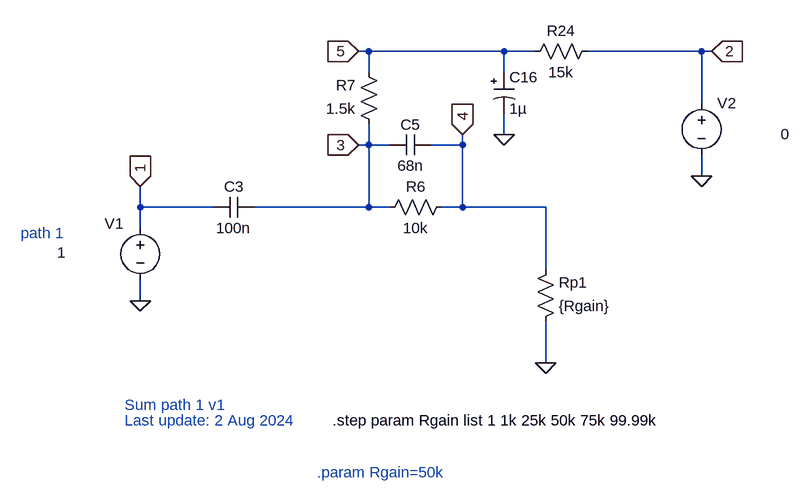
[diagram p0: schematic Klon-Centaur_sum_path1_v1.asc]
Klon-Centaur_sum_path1_v1.asc, the LTspice schematic file:
Version 4
SHEET 1 4496 5064
WIRE -32 2320 -48 2320
WIRE 176 2320 -32 2320
WIRE 224 2320 176 2320
WIRE 480 2320 304 2320
WIRE 496 2320 480 2320
WIRE -32 2352 -32 2320
WIRE 176 2352 176 2320
WIRE 480 2400 480 2320
WIRE 176 2448 176 2416
WIRE -32 2464 -32 2432
WIRE -32 2464 -48 2464
WIRE 0 2464 -32 2464
WIRE 112 2464 112 2448
WIRE 112 2464 64 2464
WIRE 480 2512 480 2480
WIRE -384 2560 -384 2528
WIRE -272 2560 -384 2560
WIRE -32 2560 -32 2464
WIRE -32 2560 -208 2560
WIRE 0 2560 -32 2560
WIRE 112 2560 112 2464
WIRE 112 2560 80 2560
WIRE 240 2560 112 2560
WIRE -384 2592 -384 2560
WIRE 240 2656 240 2560
WIRE -384 2704 -384 2672
WIRE 240 2800 240 2736
FLAG -384 2528 1
IOPIN -384 2528 In
FLAG 176 2448 0
FLAG -384 2704 0
FLAG -48 2464 3
IOPIN -48 2464 In
FLAG -48 2320 5
IOPIN -48 2320 In
FLAG 112 2448 4
IOPIN 112 2448 In
FLAG 240 2800 0
FLAG 480 2512 0
FLAG 496 2320 2
IOPIN 496 2320 In
SYMBOL voltage -384 2576 R0
WINDOW 0 -55 9 Left 2
WINDOW 39 0 0 Left 0
WINDOW 3 -128 54 Left 2
SYMATTR InstName V1
SYMATTR Value 1
SYMATTR Value2 AC 0 0
SYMBOL cap -208 2544 R90
WINDOW 0 0 32 VBottom 2
WINDOW 3 32 32 VTop 2
SYMATTR InstName C3
SYMATTR Value 100n
SYMBOL res 96 2544 R90
WINDOW 0 0 56 VBottom 2
WINDOW 3 32 56 VTop 2
SYMATTR InstName R6
SYMATTR Value 10k
SYMBOL cap 64 2448 R90
WINDOW 0 0 32 VBottom 2
WINDOW 3 32 32 VTop 2
SYMATTR InstName C5
SYMATTR Value 68n
SYMBOL res -16 2448 R180
WINDOW 0 36 76 Left 2
WINDOW 3 36 40 Left 2
SYMATTR InstName R7
SYMATTR Value 1.5k
SYMBOL res 320 2304 R90
WINDOW 0 0 56 VBottom 2
WINDOW 3 32 56 VTop 2
SYMATTR InstName R24
SYMATTR Value 15k
SYMBOL polcap 160 2352 R0
SYMATTR InstName C16
SYMATTR Value 1µ
SYMBOL res 224 2752 M180
WINDOW 0 36 76 Left 2
WINDOW 3 36 40 Left 2
SYMATTR InstName Rp1
SYMATTR Value {Rgain}
SYMBOL voltage 480 2384 R0
WINDOW 3 122 63 Left 2
WINDOW 123 0 0 Left 0
WINDOW 39 0 0 Left 0
SYMATTR Value 0
SYMATTR InstName V2
TEXT -88 2888 Left 2 !.step param Rgain list 1 1k 25k 50k 75k 99.99k
TEXT -112 2968 Left 2 ;.param Rgain=50k
TEXT -408 2864 Left 2 ;Sum path 1 v1
TEXT -568 2600 Left 2 ;path 1
TEXT -408 2888 Left 2 ;Last update: 2 Aug 2024

The netlist it stands for:
* Klon-Centaur_sum_path1_v1.asc
V1 1 0 1 AC 0 0
C3 3 1 100n
R6 4 3 10k
C5 4 3 68n
R7 3 5 1.5k
R24 2 5 15k
C16 5 0 1µ
Rp1 0 4 {Rgain}
V2 2 0 0
.step param Rgain list 1 1k 25k 50k 75k 99.99k
* .param Rgain=50k
* Sum path 1 v1
* path 1
* Last update: 2 Aug 2024
.backanno
.end